# Altium schematic sheet 907 Controller (Original - With Errors).SchDoc: 907 Soldering Station
size A4; Date: FIXED DATE; ApprovedBy: ABB; CheckedBy: CHECKED; Author: AUTHOR; CompanyName: COMPANY; DrawnBy: DRAWN BY; Engineer: ENGInEER; Organization: LUDZINC; Address1: www.ludzinc.blogspot.com; DocumentNumber: LCL_019; Revision: 0; SheetNumber: 1; SheetTotal: 1; CurrentTime: TIME; CurrentDate: DATE; Time: TIME; DocumentFullPathAndName: FULL PATH NAME; DocumentName: DOC NAME; ModifiedDate: MODOFIED; ProjectName: PROJECT; Application_BuildNumber: AB
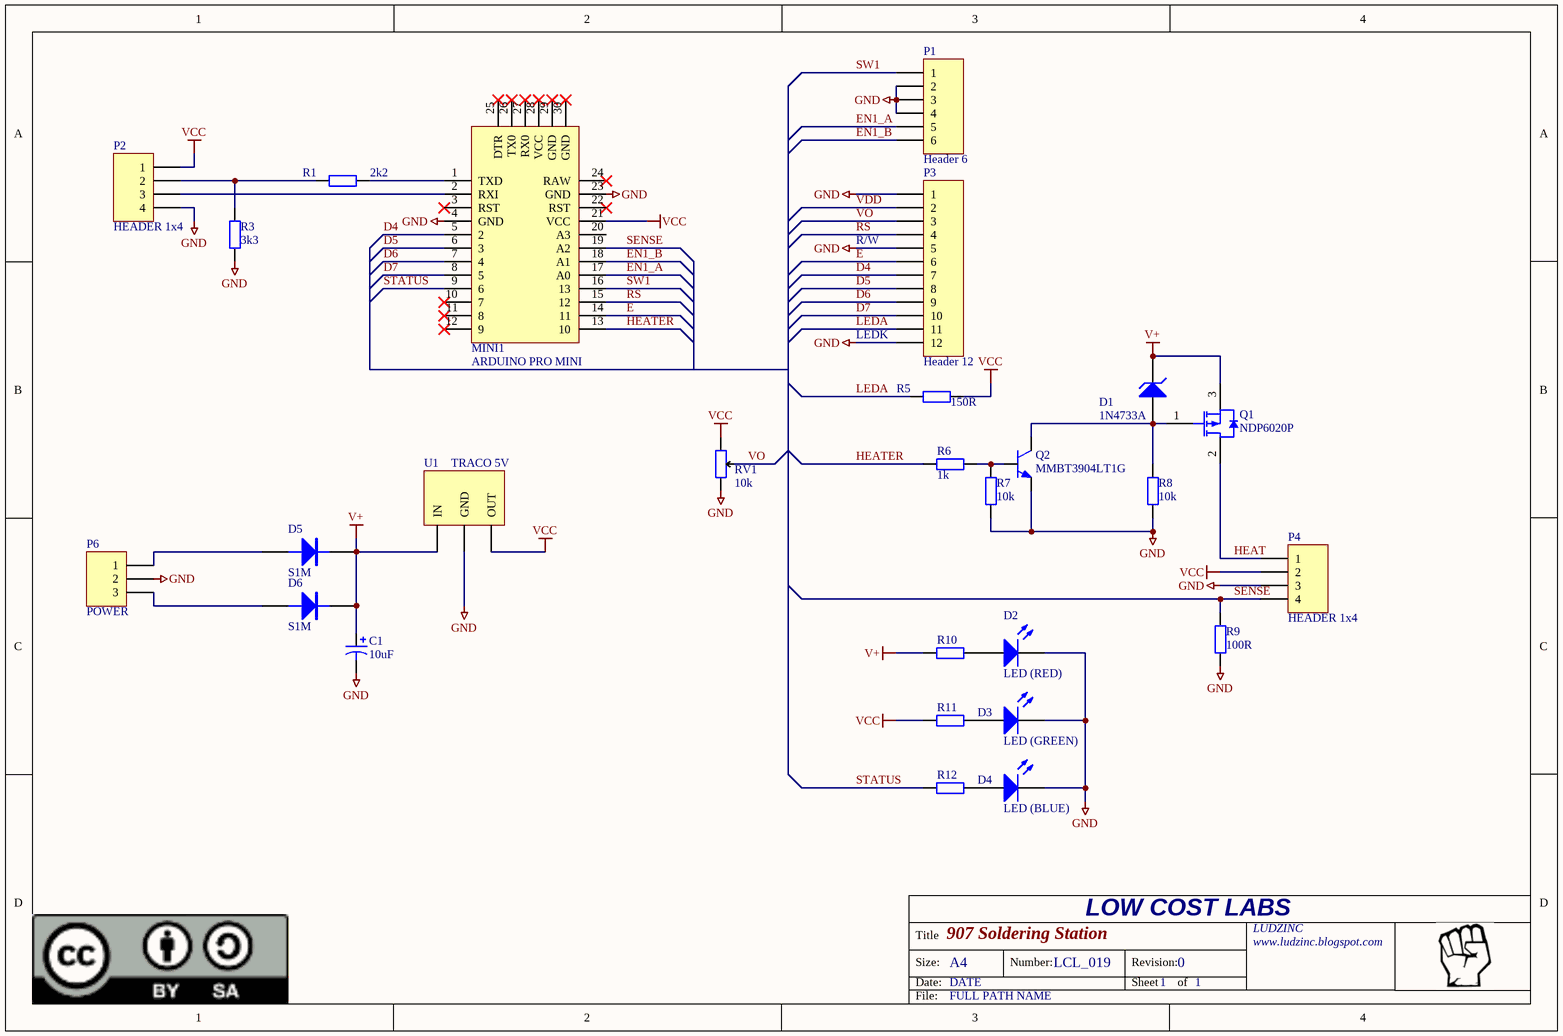
[diagram p0: 907 Controller (Original - With Errors).SchDoc]

## Parts
C1  10uF  [CAPACITOR 12.5X20]
D1  1N4733A  [DO-41]
D2  LED (RED)  [LED(3D) 3MM VERTICAL (RED)]
D3  LED (GREEN)  [LED(3D) 3MM VERTICAL (GREEN)]
D4  LED (BLUE)  [LED(3D) 3MM VERTICAL (GREEN)]
D5  S1M  [DO-214AC]
D6  S1M  [DO-214AC]
MINI1  ARDUINO PRO MINI  [ARDUINO PRO MINI]
P1  Header 6  [HEADER 1x6]
P2  HEADER 1x4  [HEADER 1x4]
P3  Header 12  [HEADER 1x12]
P4  HEADER 1x4  [HEADER 1x4]
P6  POWER  [power]
Q1  NDP6020P  [TO-220AB - RIGHT ANGLE]
Q2  MMBT3904LT1G  [SOT-23]
R1  2k2  [RESISTOR 0805]
R3  3k3  [RESISTOR 0805]
R5  150R  [RESISTOR 0805]
R6  1k  [RESISTOR 0805]
R7  10k  [RESISTOR 0805]
R8  10k  [RESISTOR 0805]
R9  100R  [RESISTOR 0805]
R10  (no value)  [RESISTOR 0805]
R11  (no value)  [RESISTOR 0805]
R12  (no value)  [RESISTOR 0805]
RV1  10k  [TRIMPOT]
U1  TRACO 5V  [TRACO TSR 1-2450]

## Nets
GND: C1.2 D2.2(K) D3.2(K) D4.2(K) MINI1.4(GND) MINI1.23(GND) P1.2 P1.3 P1.4 P2.4 P3.1 P3.5 P3.12 P4.3 P6.2 Q2.2(E) R3.2 R7.2 R8.2 R9.2 RV1.1 U1.2(GND)
V+: C1.1 D1.1(K) D5.2(K) D6.2(K) Q1.3(S) R10.1 U1.1(IN)
VCC: MINI1.21(VCC) P2.1 P4.2 R5.1 R11.1 RV1.3 U1.3(OUT)
D4: MINI1.5(2) P3.7
D5: MINI1.6(3) P3.8
D6: MINI1.7(4) P3.9
D7: MINI1.8(5) P3.10
E: MINI1.14(11) P3.6
EN1_A: MINI1.17(A0) P1.5
EN1_B: MINI1.18(A1) P1.6
HEAT: P4.1 Q1.2(D)
HEATER: MINI1.13(10) R6.1
LEDA: P3.11 R5.2
RS: MINI1.15(12) P3.4
SENSE: MINI1.19(A2) P4.4 R9.1
STATUS: MINI1.9(6) R12.1
SW1: MINI1.16(13) P1.1
VDD: P3.2
VO: P3.3 RV1.2
NetD1_2: D1.2(A) Q1.1(G) Q2.3(C) R8.1
NetD2_1: D2.1(A) R10.2
NetD3_1: D3.1(A) R11.2
NetD4_1: D4.1(A) R12.2
NetD5_1: D5.1(A) P6.1
NetD6_1: D6.1(A) P6.3
NetMINI1_1: MINI1.1(TXD) R1.2
NetMINI1_2: MINI1.2(RXI) P2.3
NetP2_2: P2.2 R1.1 R3.1
NetQ2_1: Q2.1(B) R6.2 R7.1

Not connected (* = marked no-connect by the designer): MINI1 3(RST)* 10(7)* 11(8)* 12(9)* 20(A3) 22(RST)* 24(RAW)* 25(DTR)* 26(TX0)* 27(RX0)* 28(VCC)* 29(GND)* 30(GND)*

## Notes on the sheet
- (near P3) R/W
- (near P3) LEDK
- LOW COST LABS
- Title
- Size:
- Date:
- A4
- Number:
- Revision:
- Sheet
- of
- File:

## Library data of the parts
C1 = Cap Pol1: Polarized Capacitor (Radial); Value: 10uF; LCSC Part No.: C190964
D1 = DO-41: 1N4733A 5V ZENER DO-41; Output Current: 510 mA (max); Material: Glass; Power Rating: 1.00 W; Breakdown Voltage: 5.10 V; Lead-Free Status: Lead Free; REACH SVHC Compliance: No SVHC; Manufacturer Part Number: 1N4733A; Mounting Style: Through Hole; RoHS: Compliant; Voltage Rating (DC): 5.10 V; Lifecycle Status: Active; Octopart URL: http://octopart.com/1n4733a-multicomp-19660330; Number of Pins: 2; Packaging: Bulk; Power Dissipation: 1.00 W; OctopartID: 43988bb998d49c5f; Case/Package: DO-41
D2-D4 = LED 3mm RED: 3mm RED LED; Manufacturer: Kingbright; Manufacturer Part No.: WP132XIT; Mouser Part no.: 604-WP132XIT; Farnell Part no.: 1003393; Web link: http://au.mouser.com/Search/Refine.aspx?Keyword=604-WP132XIT
D5 D6 = DIODE S1M (DO-214AC): DIODE, POWER; Manufacturer: Taiwan Semiconductor; Mouser Part no.: 821-S1M; Farnell Part no.: 9843841; Manufacturer Part No.: S1M; Web link: http://au.mouser.com/Search/Refine.aspx?Keyword=821-S1M
P1 = Header 6: Header, 6-Pin; LatestRevisionDate: 17-Jul-2002; LatestRevisionNote: Re-released for DXP Platform.; Publisher: Altium Limited
P3 = Header 12: Header, 12-Pin; LatestRevisionDate: 17-Jul-2002; LatestRevisionNote: Re-released for DXP Platform.; Publisher: Altium Limited
P6 = Header 3: Header, 3 Pin; Manufacturer: FCI; Manufacturer Part No.: 68020-102; Mouser Part no.: 649-68020-102; Web link: http://au.mouser.com/ProductDetail/FCI/68020-102/?qs=sGAEpiMZZMs%252bGHln7q6pm44kDepmYTI87r6%2fnQtKGLI%3d
Q1 = NDP6020P: Trans MOSFET P-CH 20V 24A TO-220AB NDP6020P; Drain to Source Voltage (Vds): -20.0 V; Continuous Drain Current (Ids): -24.0 A; Polarity: P-Channel; Power Dissipation: 50.0 W; Lead-Free Status: Lead Free; Drain to Source Resistance (on) (Rds): 75.0 m?; OctopartID: d65e1f9ca3c10999; Octopart URL: http://octopart.com/ndp6020p-fairchild+semiconductor-13127929; RoHS: Compliant; Current Rating: -24.0 A; REACH SVHC Compliance: No SVHC; Lifecycle Status: Active; Packaging: Tube; Manufacturer Part Number: NDP6020P; Voltage Rating (DC): -20.0 V; Number of Pins: 3; Case/Package: TO-220; Mounting Style: Through Hole
Q2 = NPN
R1 R3 R5-R12 = Res2: Resistor; Published: 8-Jun-2000; LatestRevisionDate: 17-Jul-2002; LatestRevisionNote: Re-released for DXP Platform.; PackageReference: AXIAL-0.4; Publisher: Altium Limited; PackageDescription: Axial Device, Thru-Hole; 2 Leads; 0.4 in Pin Spacing
  R1: Value: 2k2
  R3: Value: 3k3
  R5: Value: 150R
  R6: Value: 1k
  R7 R8: Value: 10k
  R9: Value: 100R
RV1 = TRIMMER
U1 = TRACO 1-2450: TRACO BUCK 1-2450 MODULE (5V)